# EAGLE schematic esquematico_placa (EAGLE 9.3.2)
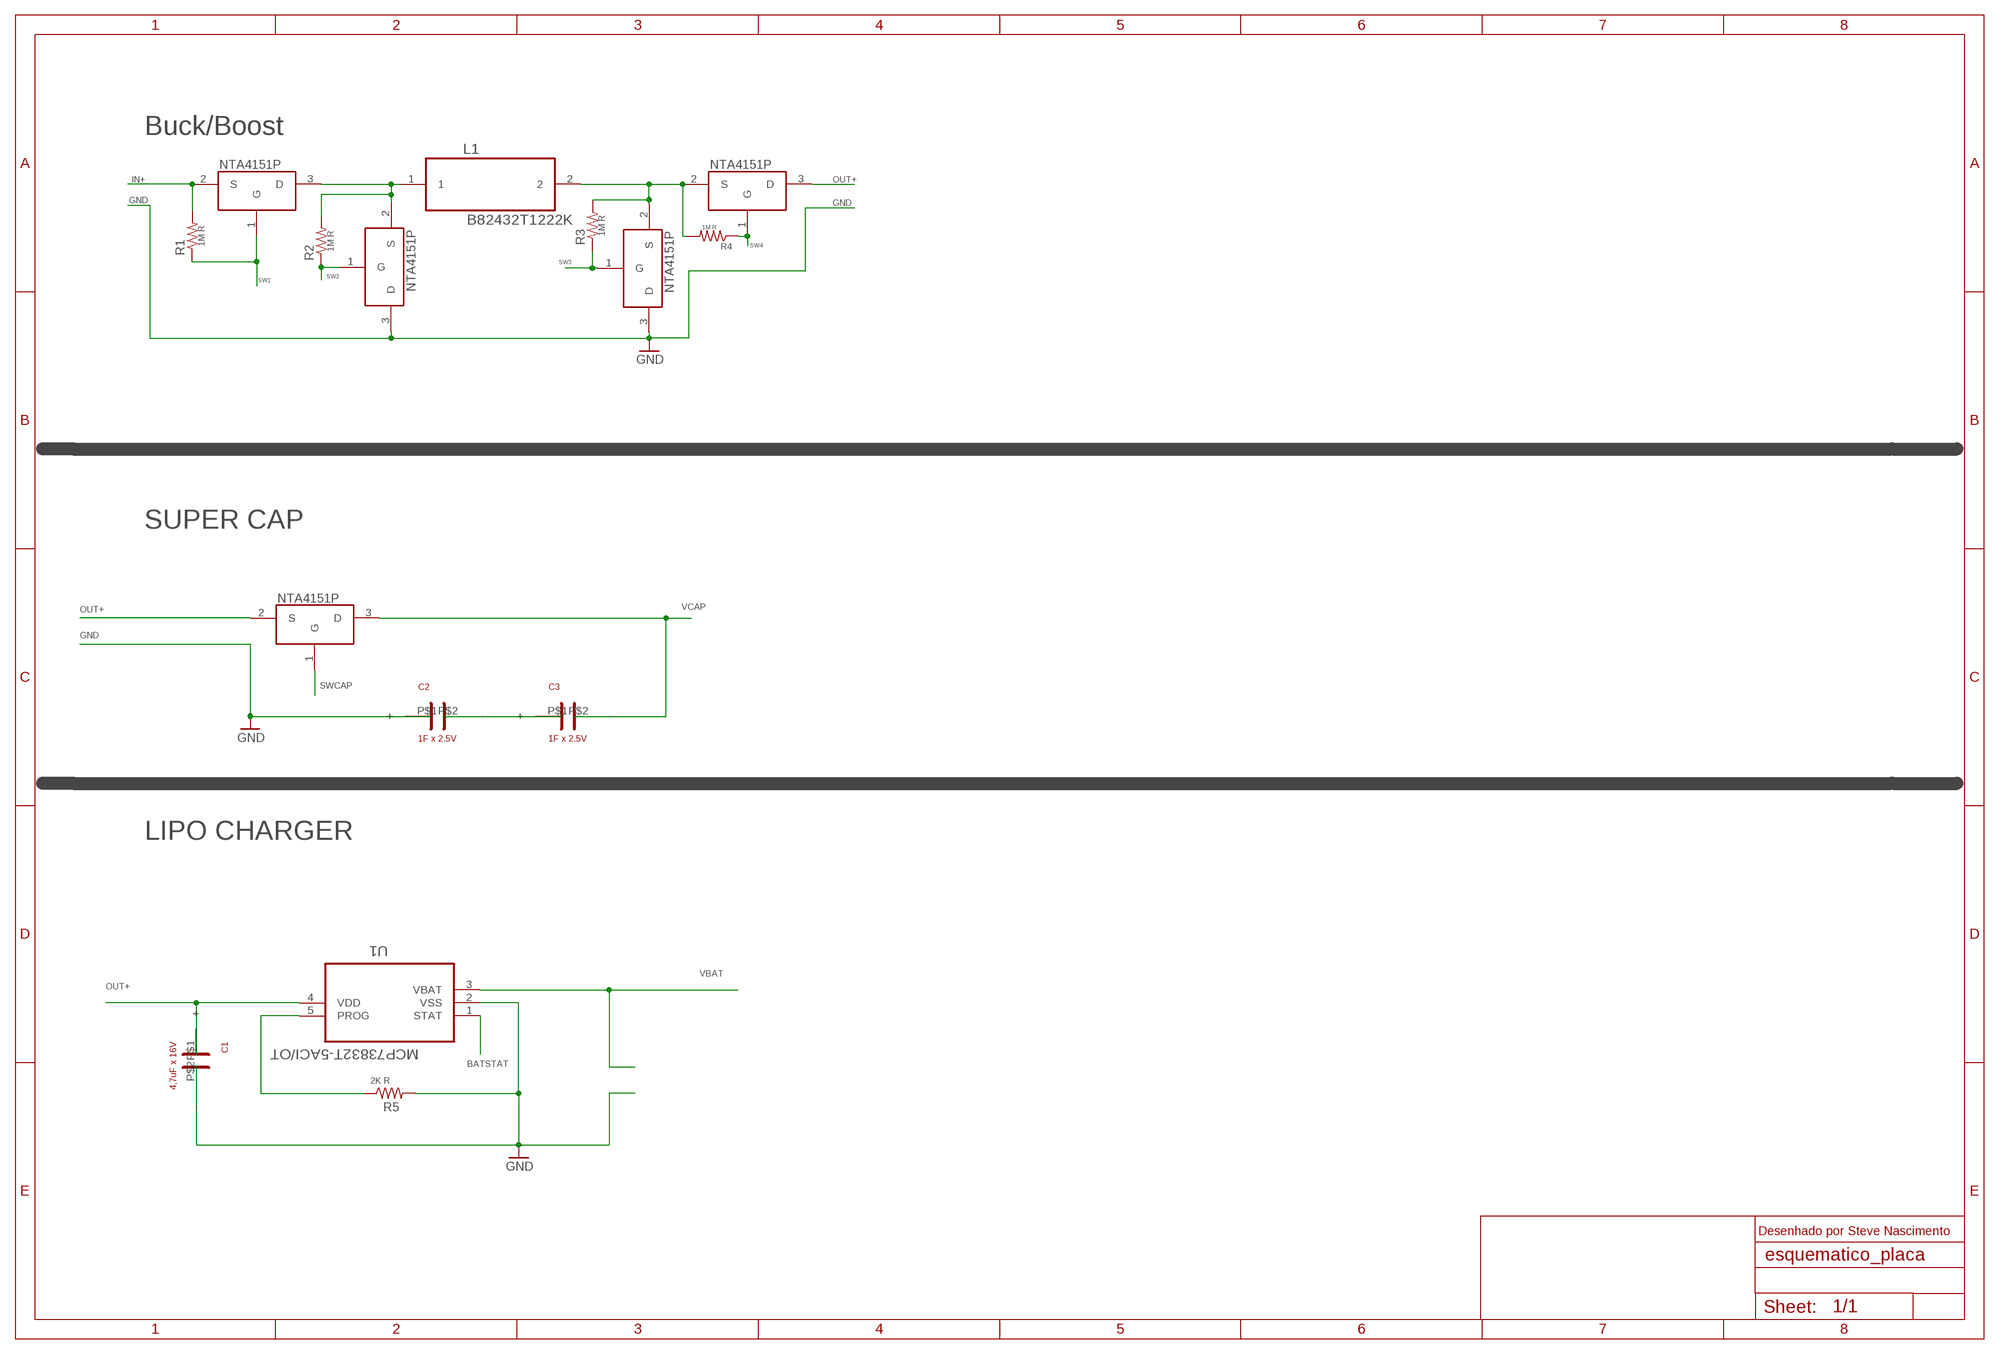
[diagram p0: schematic, sheet 1]

## Parts
C1  4,7uF x 16V  PANASONIC-SCAP-5.5V-0.1F  [PANASONIC-SCAP-5.5V-0.1F]
C2  1F x 2.5V  PANASONIC-SCAP-5.5V-0.1F  [PANASONIC-SCAP-5.5V-0.1F]
C3  1F x 2.5V  PANASONIC-SCAP-5.5V-0.1F  [PANASONIC-SCAP-5.5V-0.1F]
L1  B82432T1222K  [INDC4532X340N]
R1  1M R  CRGH0805F392R  [RESC2012X65N]
R2  1M R  CRGH0805F392R  [RESC2012X65N]
R3  1M R  CRGH0805F392R  [RESC2012X65N]
R4  1M R  CRGH0805F392R  [RESC2012X65N]
R5  2K R  CRGH0805F392R  [RESC2012X65N]
T1  NTA4151P  [SOT50P160X90-3N]
U1  MCP73832T-5ACI/OT  [SOT95P300X145-5N]
U$1  NTA4151P  [SOT50P160X90-3N]
U$2  NTA4151P  [SOT50P160X90-3N]
U$3  NTA4151P  [SOT50P160X90-3N]
U$4  NTA4151P  [SOT50P160X90-3N]

## Nets
BATSTAT: U1.1(STAT)
GND: C1.P$2(-) C2.P$1(+) R5.2 U1.2(VSS) U$2.3(D) U$3.3(D)
IN+: R1.2 T1.2(S)
N$1: L1.1 R2.2 T1.3(D) U$2.2(S)
N$2: L1.2 R3.2 R4.2 U$3.2(S) U$4.2(S)
N$3: C2.P$2(-) C3.P$1(+)
N$4: R5.1 U1.5(PROG)
OUT+: C1.P$1(+) U1.4(VDD) U$1.2(S) U$4.3(D)
SW1: R1.1 T1.1(G)
SW2: R2.1 U$2.1(G)
SW3: R3.1 U$3.1(G)
SW4: R4.1 U$4.1(G)
SWCAP: U$1.1(G)
VBAT: U1.3(VBAT)
VCAP: C3.P$2(-) U$1.3(D)

## Notes on the sheet
- Buck/Boost
- SUPER CAP
- LIPO CHARGER
- Desenhado por Steve Nascimento

## Library data of the parts
C1-C3 = SCAP-PANASONIC5.5V1F5MM20MM:PANASONIC-SCAP-5.5V-0.1F
L1 = B82432T1222K:B82432T1222K: SMT inductors; AVAILABILITY: Unavailable; DESCRIPTION: Ind Chip Molded Wirewound 2.2uH 10% 7.96MHz 10Q-Factor Ferrite 1A 1812 Blister T/R; MF: EPCOS; MP: B82432T1222K; PACKAGE: 1812 EPCOS; PRICE: None
R1-R5 = 0805 Resistor:CRGH0805F392R: RES SMD 392 OHM 1% 1/3W 0805; AVAILABILITY: Unavailable; COMMENT: 5-1879509-5; DESCRIPTION: Res Thick Film 0805 392 Ohm 1% 1/3W ±100ppm/°C Molded SMD SMD T/R; MF: TE Connectivity; MP: CRGH0805F392R; PACKAGE: 0805 TE Connectivity; PRICE: None; TE_PURCHASE_URL: https://www.te.com/usa-en/product-5-1879509-5.html?te_bu=Cor&te_type=disp&te_campaign=seda_glo_cor-seda-global-disp-prtnr-fy19-seda-model-bom-cta_sma-317_1&elqCampaignId=32493
T1 U$1-U$4 = nta4151p:NTA4151P: NTA4151P Small Signal MOSFET −20 V, −760 mA, Single P−Channel, Gate Zener, SC−75, SC−89
U1 = MCP73832T-5ACI_OT:MCP73832T-5ACI/OT: IC, BATT CHARGER, Li-Ion Li-Polymer, 500 mA; AVAILABILITY: Unavailable; DESCRIPTION: Tiny Integrated Li-Ion/Li-Poly Charge mgnt controller, 4.5V Vreg out; MF: Microchip; MP: MCP73832T-5ACI/OT; PACKAGE: SOT-23 Microchip; PRICE: None